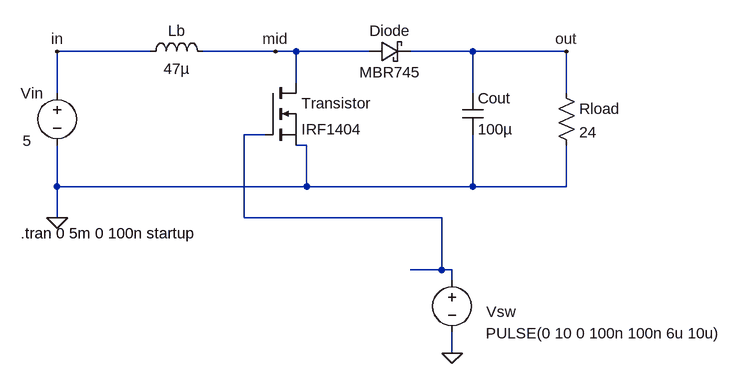
[diagram p0: schematic Boost_converter.asc]
Boost_converter.asc, the LTspice schematic file:
Version 4
SHEET 1 1356 704
WIRE 32 128 -112 128
WIRE 224 128 112 128
WIRE 256 128 224 128
WIRE 368 128 256 128
WIRE 528 128 432 128
WIRE 672 128 528 128
WIRE 256 176 256 128
WIRE -112 192 -112 128
WIRE 528 192 528 128
WIRE 672 192 672 128
WIRE 208 256 176 256
WIRE 272 272 256 272
WIRE -112 336 -112 272
WIRE 272 336 272 272
WIRE 272 336 -112 336
WIRE 528 336 528 256
WIRE 528 336 272 336
WIRE 672 336 672 272
WIRE 672 336 528 336
WIRE -112 384 -112 336
WIRE 176 384 176 256
WIRE 480 384 176 384
WIRE 480 464 480 384
WIRE 480 464 432 464
WIRE 496 464 480 464
WIRE 496 480 496 464
WIRE 496 592 496 560
FLAG -112 384 0
FLAG -112 128 in
FLAG 672 128 out
FLAG 224 128 mid
FLAG 496 592 0
SYMBOL voltage -112 176 R0
WINDOW 0 -56 16 Left 2
WINDOW 3 -53 89 Left 2
WINDOW 123 0 0 Left 0
WINDOW 39 0 0 Left 0
SYMATTR InstName Vin
SYMATTR Value 5
SYMBOL schottky 368 144 R270
WINDOW 0 32 32 VTop 2
WINDOW 3 0 32 VBottom 2
SYMATTR InstName Diode
SYMATTR Value MBR745
SYMATTR Description Diode
SYMATTR Type diode
SYMBOL nmos 208 176 R0
SYMATTR InstName Transistor
SYMATTR Value IRF1404
SYMBOL res 656 176 R0
SYMATTR InstName Rload
SYMATTR Value 24
SYMBOL voltage 496 464 R0
WINDOW 0 75 49 Top 2
WINDOW 3 234 113 Bottom 2
WINDOW 123 0 0 Left 0
WINDOW 39 0 0 Left 0
SYMATTR InstName Vsw
SYMATTR Value PULSE(0 10 0 100n 100n 6u 10u)
SYMBOL cap 512 192 R0
SYMATTR InstName Cout
SYMATTR Value 100µ
SYMATTR SpiceLine Rser=10m
SYMBOL ind 16 144 R270
WINDOW 0 32 56 VTop 2
WINDOW 3 5 56 VBottom 2
SYMATTR InstName Lb
SYMATTR Value 47µ
SYMATTR SpiceLine Rser=10m
TEXT -168 408 Left 2 !.tran 0 5m 0 100n startup

The netlist it stands for:
* Boost_converter.asc
Vin in 0 5
Diode mid out MBR745
M§Transistor mid N001 0 0 IRF1404
Rload out 0 24
Vsw N001 0 PULSE(0 10 0 100n 100n 6u 10u)
Cout out 0 100µ Rser=10m
Lb in mid 47µ Rser=10m
.model D D
.lib standard.dio
.model NMOS NMOS
.model PMOS PMOS
.lib standard.mos
.tran 0 5m 0 100n startup
.backanno
.end